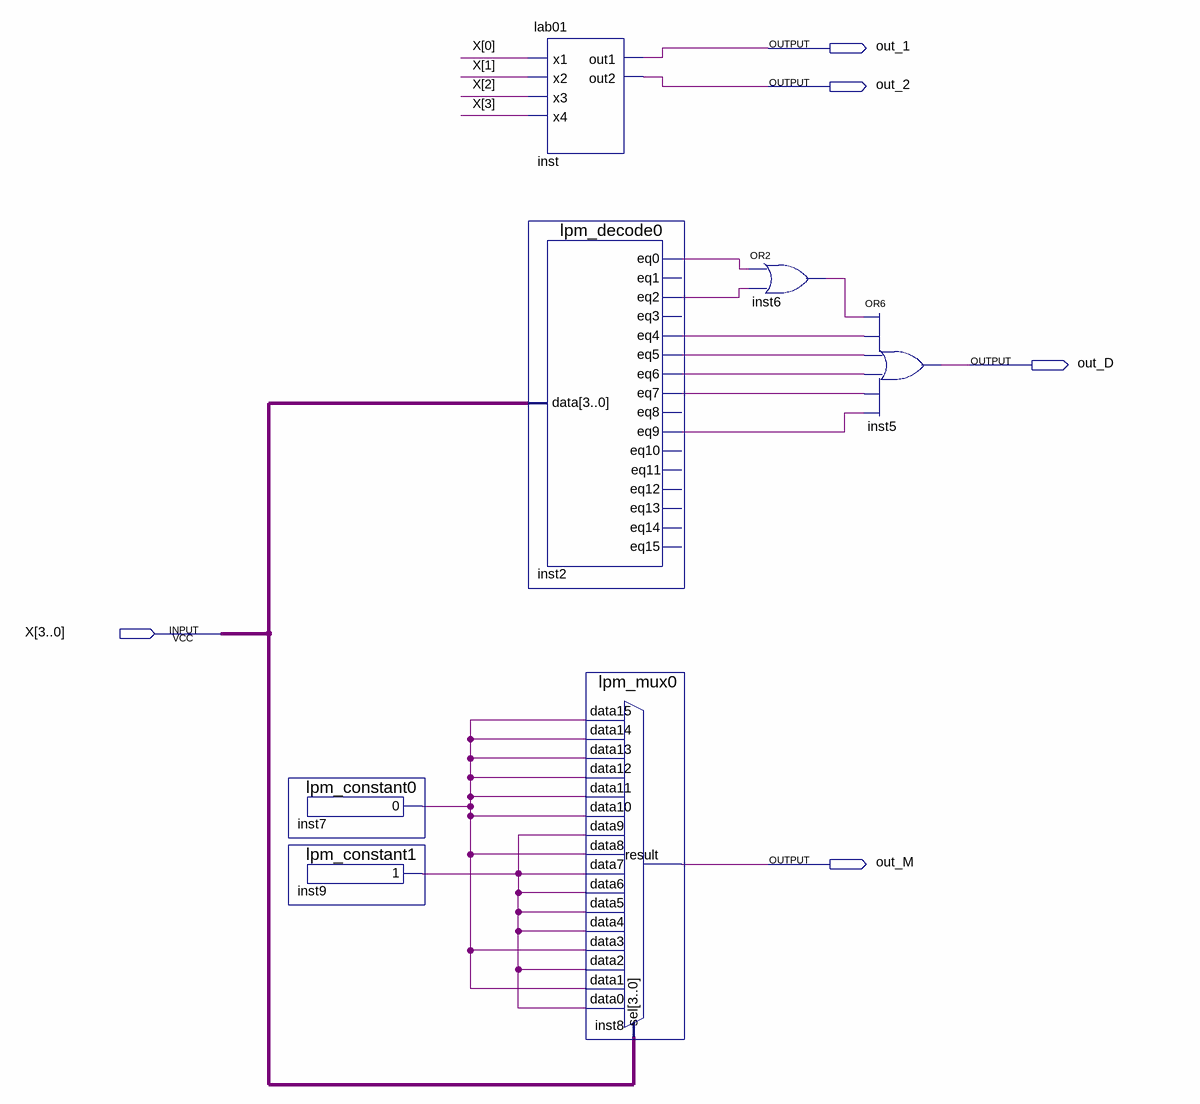
[diagram p0: schematic sheet]
// Quartus schematic lab02.bdf as structural Verilog: 7 symbols, 5 pins
module lab02 (
  input  [3:0] X,
  output out_1,
  output out_2,
  output out_D,
  output out_M
);

  wire inst2_eq0, inst2_eq2, inst2_eq4, inst2_eq5, inst2_eq6, inst2_eq7, inst2_eq9, inst6_out, inst7_result,
       inst9_result;

  lpm_constant0 inst7 (.result(inst7_result));
  lpm_constant1 inst9 (.result(inst9_result));
  lab01 inst (.x1(X[0]), .x2(X[1]), .x3(X[2]), .x4(X[3]), .out1(out_1), .out2(out_2));
  lpm_decode0 inst2 (
    .data(X), .eq0(inst2_eq0), .eq2(inst2_eq2), .eq4(inst2_eq4), .eq5(inst2_eq5), .eq6(inst2_eq6),
    .eq7(inst2_eq7), .eq9(inst2_eq9));  // open: eq1, eq3, eq8, eq10, eq11, eq12, eq13, eq14, eq15
  lpm_mux0 inst8 (
    .data15(inst7_result), .data14(inst7_result), .data13(inst7_result), .data12(inst7_result),
    .data11(inst7_result), .data10(inst7_result), .data9(inst9_result), .data8(inst7_result),
    .data7(inst9_result), .data6(inst9_result), .data5(inst9_result), .data4(inst9_result),
    .data3(inst7_result), .data2(inst9_result), .data1(inst7_result), .data0(inst9_result), .sel(X),
    .result(out_M));
  or inst6 (inst6_out, inst2_eq0, inst2_eq2);
  or inst5 (out_D, inst6_out, inst2_eq4, inst2_eq5, inst2_eq6, inst2_eq7, inst2_eq9);
endmodule
